# Altium schematic sheet Temp_recorder_SAMD21.SchDoc: 8 channel
size 420 x 297 mm; Author: G.Kasprowicz; CompanyName: WUT ISE; DrawnBy: G.Kasprowicz; Organization: WUT ISE; Address1: PW ISE; Address2: Nowowiejska 15/19 00-665 Warsaw; Address3: gkasprow@gmail.com; DocumentNumber: 1; Revision: 1.0; SheetNumber: 1; SheetTotal: 5; ModifiedBy: -; CheckedDate: -; Title2: temperature logger; DivGrp: WUT ISE; Designer: G.Kasprowicz; ModifiedDate: -; ProjectName: Sensor Box
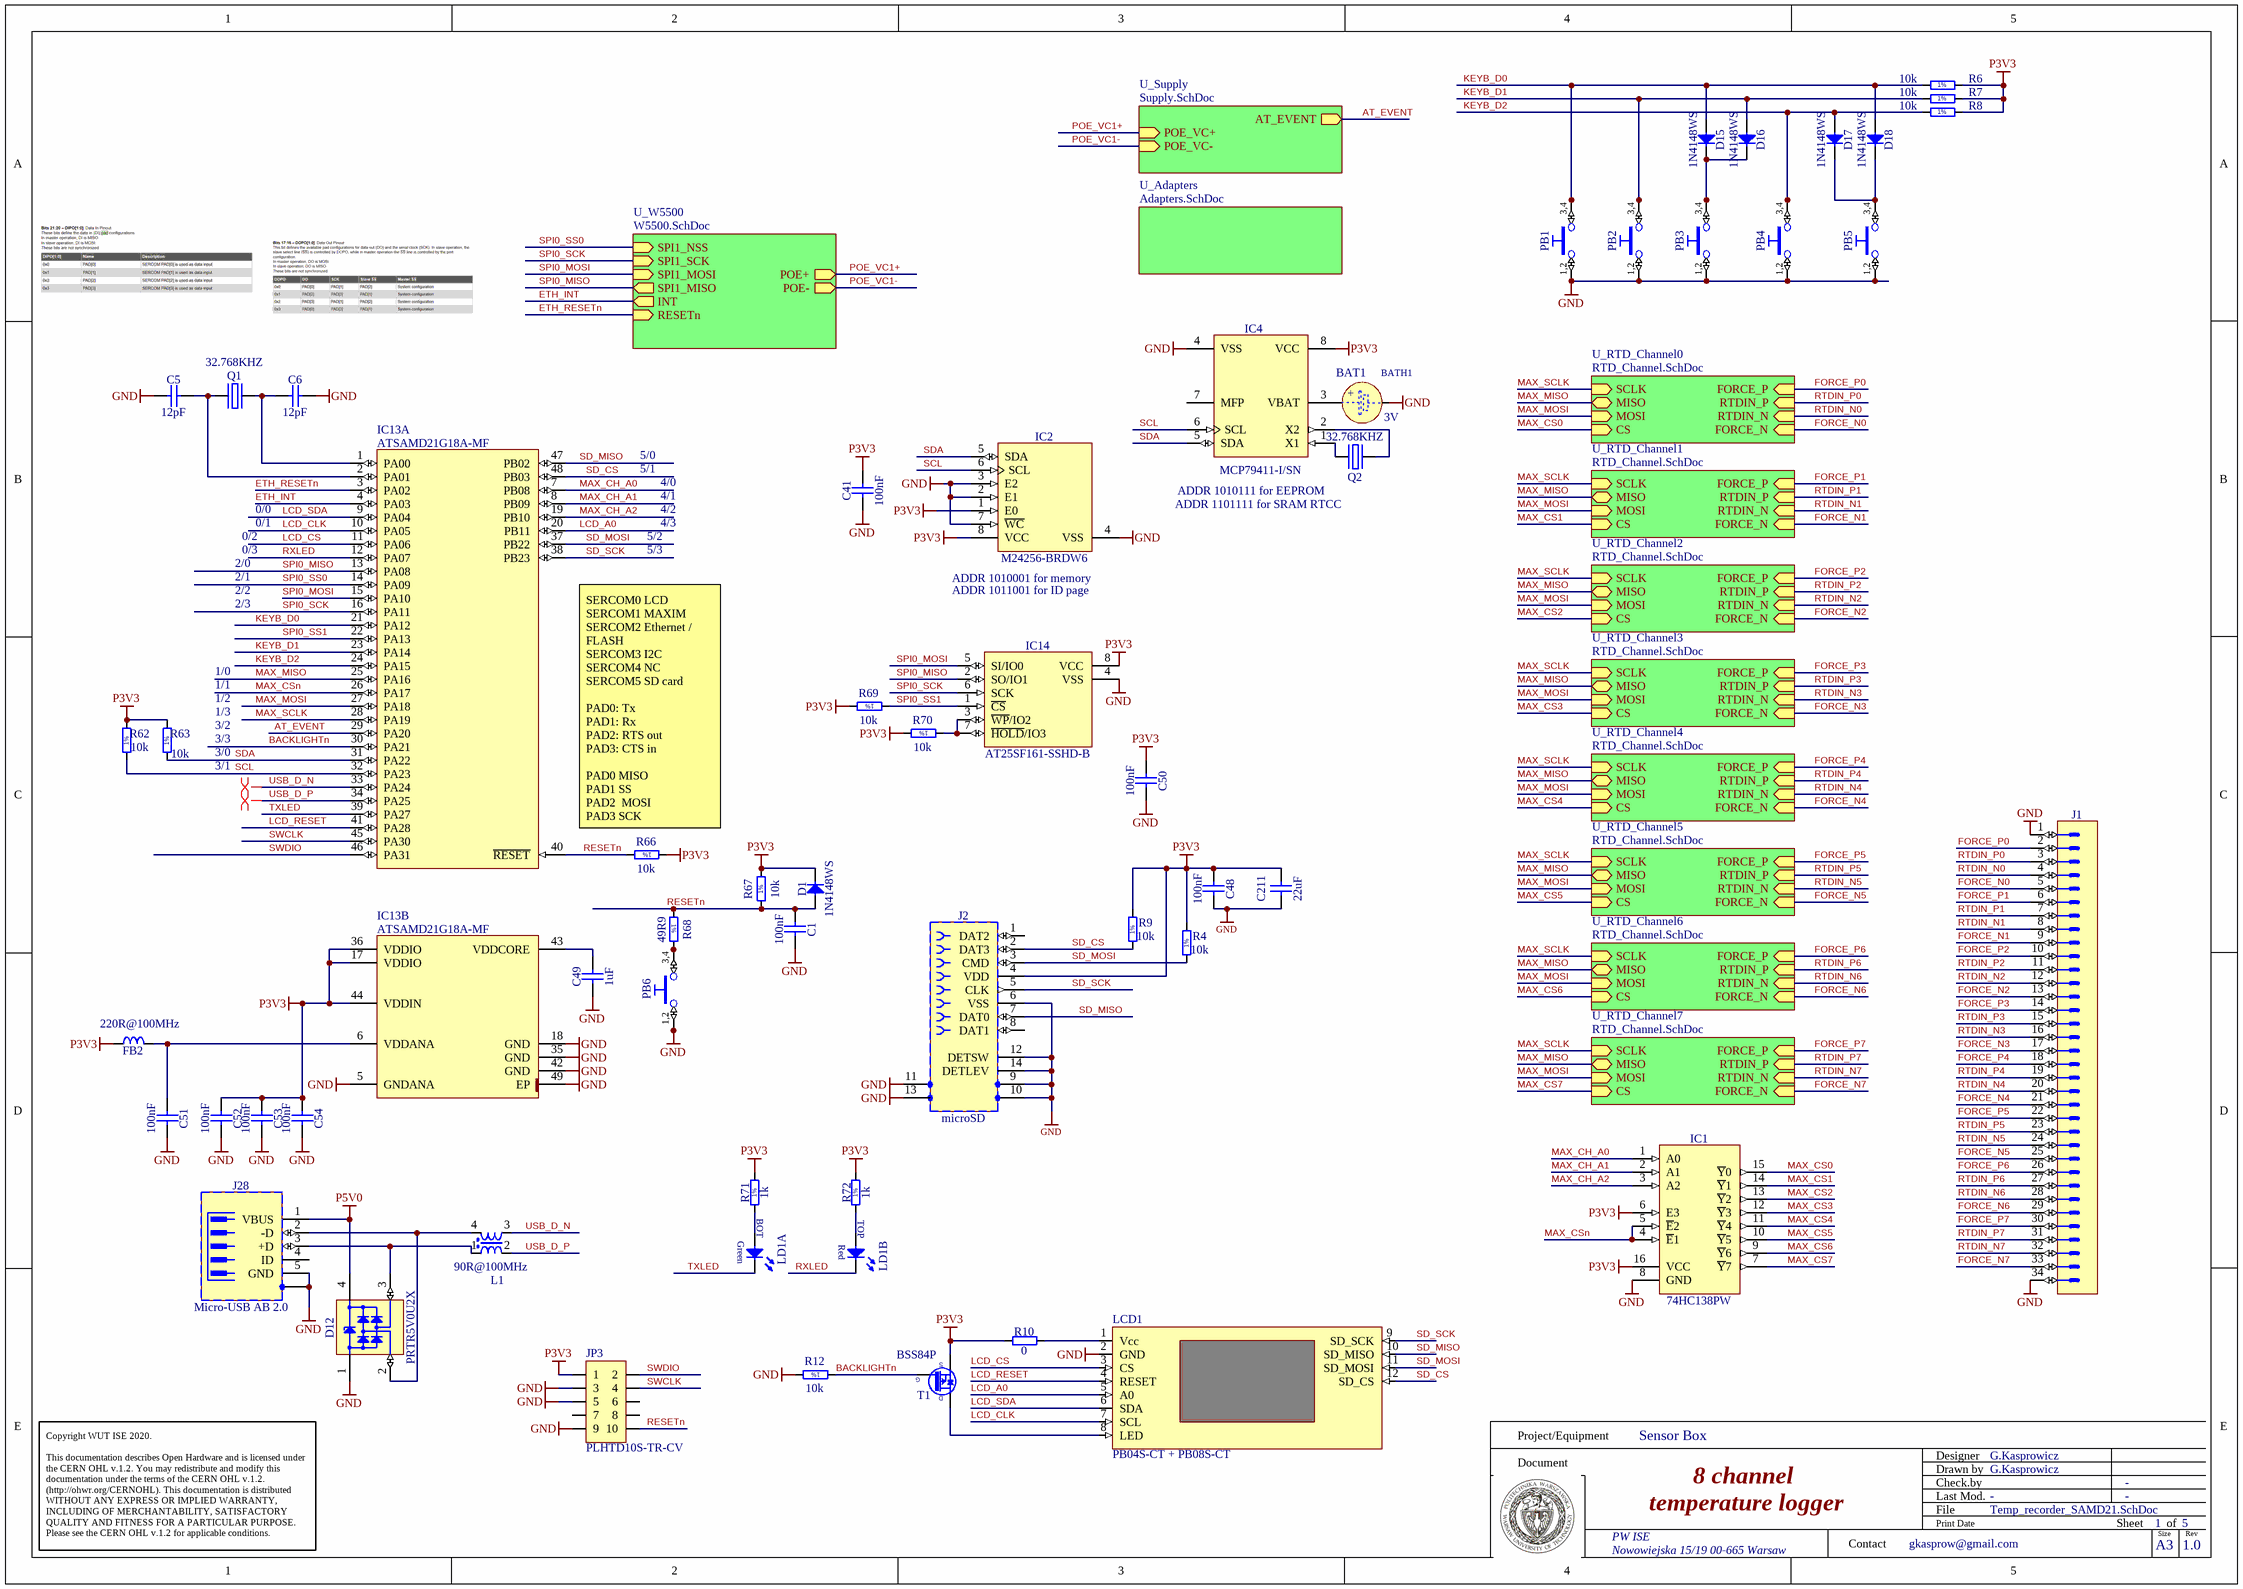
[diagram p0: Temp_recorder_SAMD21.SchDoc]

## Parts
BAT1  3V  [BAT_VARTA_CR1220]
BATH1  (no value)  [BATH_KEYSTONE_3000]
C1  100nF  [CAPC1005X55N]
C5  12pF  [CAPC1005X55N]
C6  12pF  [CAPC1005X55N]
C41  100nF  [CAPC1005X55N]
C48  100nF  [CAPC1005X55N]
C49  1uF  [CAPC1608X87N]
C50  100nF  [CAPC1005X55N]
C51  100nF  [CAPC1005X55N]
C52  100nF  [CAPC1005X55N]
C53  100nF  [CAPC1005X55N]
C54  100nF  [CAPC1005X55N]
C211  22uF  [CAPC2012X135N]
D1  1N4148WS  [SODFL2512X100N]
D12  PRTR5V0U2X  [SOT190P230X110-4N]
D15  1N4148WS  [SODFL2512X100N]
D16  1N4148WS  [SODFL2512X100N]
D17  1N4148WS  [SODFL2512X100N]
D18  1N4148WS  [SODFL2512X100N]
FB2  220R@100MHz  [INDC2012X105N]
IC1  74HC138PW  [SOP65P640X110-16N]
IC2  M24256-BRDW6  [SOP65P640X120-8N]
IC4  MCP79411-I/SN  [SOIC127P600X175-8N]
IC13  ATSAMD21G18A-MF  [QFN50P700X700X100-49N-S525]  (parts A,B of 2)
IC14  AT25SF161-SSHD-B  [SOIC127P790X216-8N]
J1  Header 34  [3M_N2534-5002RB]  (value not drawn)
J2  microSD  [MOLEX_502570-0893]
J28  Micro-USB AB 2.0  [HIROSE_ZX62RD-AB-5P8(30)]
JP3  PLHTD10S-TR-CV  [PLHTD10S-TR-CV]
L1  90R@100MHz  [IND_MURATA_DLW21S]
LCD1  PB04S-CT + PB08S-CT  [1.8TFT_Connectors]
LD1  Red/Green  [LED_DIALIGHT_571-0112F]  (value not drawn)  (parts A,B of 2)
PB1  Push Button  [PB_TYCO_FSM6JSMA]  (value not drawn)
PB2  Push Button  [PB_TYCO_FSM6JSMA]  (value not drawn)
PB3  Push Button  [PB_TYCO_FSM6JSMA]  (value not drawn)
PB4  Push Button  [PB_TYCO_FSM6JSMA]  (value not drawn)
PB5  Push Button  [PB_TYCO_FSM6JSMA]  (value not drawn)
PB6  Push Button  [PB_TYCO_FSM6JSMA]  (value not drawn)
Q1  32.768KHZ  [XTAL_ABRACON_ABS09]
Q2  32.768KHZ  [XTAL_ABRACON_ABS09]
R4  10k  [RESC1005X40N]
R6  10k  [RESC1005X40N]
R7  10k  [RESC1005X40N]
R8  10k  [RESC1005X40N]
R9  10k  [RESC1005X40N]
R10  0  [RESC1005X40N]
R12  10k  [RESC1005X40N]
R62  10k  [RESC1005X40N]
R63  10k  [RESC1005X40N]
R66  10k  [RESC1005X40N]
R67  10k  [RESC1005X40N]
R68  49R9  [RESC1005X40N]
R69  10k  [RESC1005X40N]
R70  10k  [RESC1005X40N]
R71  1k  [RESC1005X40N]
R72  1k  [RESC1005X40N]
T1  BSS84P  [SOT95P240X110-3N]

## Sub-sheets
U_Adapters = Adapters.SchDoc: no entries
U_RTD_Channel0 = RTD_Channel.SchDoc: SCLK (in), CS (in), MOSI (in), MISO (bidir), RTDIN_N (in), RTDIN_P (in), FORCE_P (in), FORCE_N (in)
U_RTD_Channel1 = RTD_Channel.SchDoc: SCLK (in), CS (in), MOSI (in), MISO (bidir), RTDIN_N (in), RTDIN_P (in), FORCE_P (in), FORCE_N (in)
U_RTD_Channel2 = RTD_Channel.SchDoc: SCLK (in), CS (in), MOSI (in), MISO (bidir), RTDIN_N (in), RTDIN_P (in), FORCE_P (in), FORCE_N (in)
U_RTD_Channel3 = RTD_Channel.SchDoc: SCLK (in), CS (in), MOSI (in), MISO (bidir), RTDIN_N (in), RTDIN_P (in), FORCE_P (in), FORCE_N (in)
U_RTD_Channel4 = RTD_Channel.SchDoc: SCLK (in), CS (in), MOSI (in), MISO (bidir), RTDIN_N (in), RTDIN_P (in), FORCE_P (in), FORCE_N (in)
U_RTD_Channel5 = RTD_Channel.SchDoc: SCLK (in), CS (in), MOSI (in), MISO (bidir), RTDIN_N (in), RTDIN_P (in), FORCE_P (in), FORCE_N (in)
U_RTD_Channel6 = RTD_Channel.SchDoc: SCLK (in), CS (in), MOSI (in), MISO (bidir), RTDIN_N (in), RTDIN_P (in), FORCE_P (in), FORCE_N (in)
U_RTD_Channel7 = RTD_Channel.SchDoc: SCLK (in), CS (in), MOSI (in), MISO (bidir), RTDIN_N (in), RTDIN_P (in), FORCE_P (in), FORCE_N (in)
U_Supply = Supply.SchDoc: AT_EVENT (out), POE_VC+ (in), POE_VC- (in)
U_W5500 = W5500.SchDoc: SPI1_NSS (in), SPI1_SCK (in), SPI1_MOSI (in), SPI1_MISO (out), INT (out), RESETn (in), POE+ (out), POE- (out)

## Nets
GND: BATH1.2(MINUS) C1.2 C5.1 C6.2 C41.1 C48.2 C49.1 C50.2 C51.2 C52.2 C53.2 C54.2 C211.1 D12.1(GND) IC1.8(GND) IC2.2(E1) IC2.3(E2) IC2.4(VSS) IC2.7(~{WC}) IC4.4(VSS) IC13.5(GNDANA) IC13.18(GND) IC13.35(GND) IC13.42(GND) IC13.49(EP) IC14.4(VSS) J1.1 J1.34 J2.6(VSS) J2.9 J2.10 J2.11 J2.12(DETSW) J2.13 J2.14(DETLEV) J28.5(GND) J28.6(SH) JP3.3 JP3.5 JP3.9 LCD1.2(GND) PB1.1 PB1.2 PB2.1 PB2.2 PB3.1 PB3.2 PB4.1 PB4.2 PB5.1 PB5.2 PB6.1 PB6.2 R12.2
P3V3: C41.2 C48.1 C50.1 C52.1 C53.1 C54.1 C211.2 D1.1(C) FB2.1 IC1.6(E3) IC1.16(VCC) IC2.1(E0) IC2.8(VCC) IC4.8(VCC) IC13.17(VDDIO) IC13.36(VDDIO) IC13.44(VDDIN) IC14.8(VCC) J2.4(VDD) JP3.1 R4.2 R6.2 R7.2 R8.2 R9.2 R10.1 R62.2 R63.2 R66.1 R67.2 R69.2 R70.2 R71.2 R72.2 T1.2(S)
P5V0: D12.4(VCC) J28.1(VBUS)
AT_EVENT: IC13.29(PA20) ; sheet U_Supply/AT_EVENT
BACKLIGHTn: IC13.30(PA21) R12.1 T1.1(G)
ETH_INT: IC13.4(PA03) ; sheet U_W5500/INT
ETH_RESETn: IC13.3(PA02) ; sheet U_W5500/RESETn
FORCE_N0: J1.5 ; sheet U_RTD_Channel0/FORCE_N
FORCE_N1: J1.9 ; sheet U_RTD_Channel1/FORCE_N
FORCE_N2: J1.13 ; sheet U_RTD_Channel2/FORCE_N
FORCE_N3: J1.17 ; sheet U_RTD_Channel3/FORCE_N
FORCE_N4: J1.21 ; sheet U_RTD_Channel4/FORCE_N
FORCE_N5: J1.25 ; sheet U_RTD_Channel5/FORCE_N
FORCE_N6: J1.29 ; sheet U_RTD_Channel6/FORCE_N
FORCE_N7: J1.33 ; sheet U_RTD_Channel7/FORCE_N
FORCE_P0: J1.2 ; sheet U_RTD_Channel0/FORCE_P
FORCE_P1: J1.6 ; sheet U_RTD_Channel1/FORCE_P
FORCE_P2: J1.10 ; sheet U_RTD_Channel2/FORCE_P
FORCE_P3: J1.14 ; sheet U_RTD_Channel3/FORCE_P
FORCE_P4: J1.18 ; sheet U_RTD_Channel4/FORCE_P
FORCE_P5: J1.22 ; sheet U_RTD_Channel5/FORCE_P
FORCE_P6: J1.26 ; sheet U_RTD_Channel6/FORCE_P
FORCE_P7: J1.30 ; sheet U_RTD_Channel7/FORCE_P
KEYB_D0: D15.2(A) D18.2(A) IC13.21(PA12) PB1.3 PB1.4 R6.1
KEYB_D1: D16.2(A) IC13.23(PA14) PB2.3 PB2.4 R7.1
KEYB_D2: D17.2(A) IC13.24(PA15) PB4.3 PB4.4 R8.1
LCD_A0: IC13.20(PB11) LCD1.5(A0)
LCD_CLK: IC13.10(PA05) LCD1.7(SCL)
LCD_CS: IC13.11(PA06) LCD1.3(CS)
LCD_RESET: IC13.41(PA28) LCD1.4(RESET)
LCD_SDA: IC13.9(PA04) LCD1.6(SDA)
MAX_CH_A0: IC1.1(A0) IC13.7(PB08)
MAX_CH_A1: IC1.2(A1) IC13.8(PB09)
MAX_CH_A2: IC1.3(A2) IC13.19(PB10)
MAX_CS0: IC1.15(~{Y}0) ; sheet U_RTD_Channel0/CS
MAX_CS1: IC1.14(~{Y}1) ; sheet U_RTD_Channel1/CS
MAX_CS2: IC1.13(~{Y}2) ; sheet U_RTD_Channel2/CS
MAX_CS3: IC1.12(~{Y}3) ; sheet U_RTD_Channel3/CS
MAX_CS4: IC1.11(~{Y}4) ; sheet U_RTD_Channel4/CS
MAX_CS5: IC1.10(~{Y}5) ; sheet U_RTD_Channel5/CS
MAX_CS6: IC1.9(~{Y}6) ; sheet U_RTD_Channel6/CS
MAX_CS7: IC1.7(~{Y}7) ; sheet U_RTD_Channel7/CS
MAX_CSn: IC1.4(~{E}1) IC1.5(~{E}2) IC13.26(PA17)
MAX_MISO: IC13.25(PA16) ; sheet U_RTD_Channel0/MISO, sheet U_RTD_Channel1/MISO, sheet U_RTD_Channel2/MISO, sheet U_RTD_Channel3/MISO, sheet U_RTD_Channel4/MISO, sheet U_RTD_Channel5/MISO, sheet U_RTD_Channel6/MISO, sheet U_RTD_Channel7/MISO
MAX_MOSI: IC13.27(PA18) ; sheet U_RTD_Channel0/MOSI, sheet U_RTD_Channel1/MOSI, sheet U_RTD_Channel2/MOSI, sheet U_RTD_Channel3/MOSI, sheet U_RTD_Channel4/MOSI, sheet U_RTD_Channel5/MOSI, sheet U_RTD_Channel6/MOSI, sheet U_RTD_Channel7/MOSI
MAX_SCLK: IC13.28(PA19) ; sheet U_RTD_Channel0/SCLK, sheet U_RTD_Channel1/SCLK, sheet U_RTD_Channel2/SCLK, sheet U_RTD_Channel3/SCLK, sheet U_RTD_Channel4/SCLK, sheet U_RTD_Channel5/SCLK, sheet U_RTD_Channel6/SCLK, sheet U_RTD_Channel7/SCLK
POE_VC1+: sheet U_W5500/POE+, sheet U_Supply/POE_VC+
POE_VC1-: sheet U_W5500/POE-, sheet U_Supply/POE_VC-
RESETn: C1.1 D1.2(A) IC13.40(~{RESET}) JP3.10 R66.2 R67.1 R68.1
RTDIN_N0: J1.4 ; sheet U_RTD_Channel0/RTDIN_N
RTDIN_N1: J1.8 ; sheet U_RTD_Channel1/RTDIN_N
RTDIN_N2: J1.12 ; sheet U_RTD_Channel2/RTDIN_N
RTDIN_N3: J1.16 ; sheet U_RTD_Channel3/RTDIN_N
RTDIN_N4: J1.20 ; sheet U_RTD_Channel4/RTDIN_N
RTDIN_N5: J1.24 ; sheet U_RTD_Channel5/RTDIN_N
RTDIN_N6: J1.28 ; sheet U_RTD_Channel6/RTDIN_N
RTDIN_N7: J1.32 ; sheet U_RTD_Channel7/RTDIN_N
RTDIN_P0: J1.3 ; sheet U_RTD_Channel0/RTDIN_P
RTDIN_P1: J1.7 ; sheet U_RTD_Channel1/RTDIN_P
RTDIN_P2: J1.11 ; sheet U_RTD_Channel2/RTDIN_P
RTDIN_P3: J1.15 ; sheet U_RTD_Channel3/RTDIN_P
RTDIN_P4: J1.19 ; sheet U_RTD_Channel4/RTDIN_P
RTDIN_P5: J1.23 ; sheet U_RTD_Channel5/RTDIN_P
RTDIN_P6: J1.27 ; sheet U_RTD_Channel6/RTDIN_P
RTDIN_P7: J1.31 ; sheet U_RTD_Channel7/RTDIN_P
RXLED: IC13.12(PA07) LD1.3(C)
SCL: IC2.6(SCL) IC4.6(SCL) IC13.32(PA23) R62.1
SD_CS: IC13.48(PB03) J2.2(DAT3) LCD1.12(SD_CS) R9.1
SD_MISO: IC13.47(PB02) J2.7(DAT0) LCD1.10(SD_MISO)
SD_MOSI: IC13.37(PB22) J2.3(CMD) LCD1.11(SD_MOSI) R4.1
SD_SCK: IC13.38(PB23) J2.5(CLK) LCD1.9(SD_SCK)
SDA: IC2.5(SDA) IC4.5(SDA) IC13.31(PA22) R63.1
SPI0_MISO: IC13.13(PA08) IC14.2(SO/IO1) ; sheet U_W5500/SPI1_MISO
SPI0_MOSI: IC13.15(PA10) IC14.5(SI/IO0) ; sheet U_W5500/SPI1_MOSI
SPI0_SCK: IC13.16(PA11) IC14.6(SCK) ; sheet U_W5500/SPI1_SCK
SPI0_SS0: IC13.14(PA09) ; sheet U_W5500/SPI1_NSS
SPI0_SS1: IC13.22(PA13) IC14.1(~{CS}) R69.1
SWCLK: IC13.45(PA30) JP3.4
SWDIO: IC13.46(PA31) JP3.2
TXLED: IC13.39(PA27) LD1.1(C)
USB_D_N: IC13.33(PA24) L1.3
USB_D_P: IC13.34(PA25) L1.2
NetBATH1_1: BATH1.1(PLUS) IC4.3(VBAT)
NetC5_2: C5.2 IC13.2(PA01) Q1.1(OSC1)
NetC6_1: C6.1 IC13.1(PA00) Q1.2(OSC2)
NetC49_2: C49.2 IC13.43(VDDCORE)
NetC51_1: C51.1 FB2.2 IC13.6(VDDANA)
NetD12_2: D12.2(I/O1) J28.2(-D) L1.4
NetD12_3: D12.3(I/O2) J28.3(+D) L1.1
NetD15_1: D15.1(C) D16.1(C) PB3.3 PB3.4
NetD17_1: D17.1(C) D18.1(C) PB5.3 PB5.4
NetIC4_1: IC4.1(X1) Q2.1(OSC1)
NetIC4_2: IC4.2(X2) Q2.2(OSC2)
NetIC14_3: IC14.3(~{WP}/IO2) IC14.7(~{HOLD}/IO3) R70.1
NetLCD1_1: LCD1.1(Vcc) R10.2
NetLCD1_8: LCD1.8(LED) T1.3(D)
NetLD1_2: LD1.2(A) R71.1
NetLD1_4: LD1.4(A) R72.1
NetPB6_3: PB6.3 PB6.4 R68.2

Not connected (* = marked no-connect by the designer): IC4 7(MFP); J2 1(DAT2) 8(DAT1); J28 4(ID); JP3 6 7 8

## Layout directives
differential pair: USB_D_N, USB_D_P

## Notes on the sheet
- 5/0
- 0/0
- 0/1
- 5/1
- 4/0
- 4/1
- 4/2
- 4/3
- ADDR 1101111 for SRAM RTCC
- ADDR 1010111 for EEPROM
- 2/0
- 2/1
- 2/2
- 0/2
- 0/3
- 5/2
- 5/3
- (near IC2) ADDR 1010001 for memory
- ADDR 1011001 for ID page
- 2/3
- (near R63) 3/2
- 1/0
- 1/1
- (near R63) 1/2
- (near R63) 1/3
- (near R63) 3/0
- (near R63) 3/1
- (near R63) 3/3
- SERCOM0 LCD
  SERCOM1 MAXIM
  SERCOM2 Ethernet / FLASH
  SERCOM3 I2C
  SERCOM4 NC
  SERCOM5 SD card
  PAD0: Tx
  PAD1: Rx
  PAD2: RTS out
  PAD3: CTS in
  PAD0 MISO
  PAD1 SS
  PAD2  MOSI
  PAD3 SCK
- Project/Equipment
- Document
- Designer
- Drawn by
- Check.by
- Copyright WUT ISE 2020.
  This documentation describes Open Hardware and is licensed under the CERN OHL v.1.2. You may redistribute and modify this documentation under the terms of the CERN OHL v.1.2. (http://ohwr.org/CERNOHL). This documentation is distributed WITHOUT ANY EXPRESS OR IMPLIED WARRANTY, INCLUDING OF MERCHANTABILITY, SATISFACTORY QUALITY AND FITNESS FOR A PARTICULAR PURPOSE. Please see the CERN OHL v.1.2 for applicable conditions.
- Contact
- File
- Last Mod.
- Print Date
- Sheet
- Size
- A3
- of
- Rev
- (in symbol BAT_VARTA_CR1220) +
- (in symbol BATH_KEYSTONE_3000) +
- (in symbol LED_DIALIGHT_571-0112F, part A) BOT; Green
- (in symbol LED_DIALIGHT_571-0112F, part B) TOP; Red
- (in symbol PB_TYCO_FSM6JSMA) 3,4; 1,2
- (in symbol R0402_1K_1%_0.0625W_100PPM) 1%
- (in symbol R0402_10K_1%_0.0625W_100PPM) 1%
- (in symbol R0402_49R9_1%_0.0625W_100PPM) 1%

## Library data of the parts
BAT1 = BAT_VARTA_CR1220: Battery for use only with Socket Holder; Part Description: CR1210, 12.5mm Diameter x 2mm  Height Lithium Coin Cells; Manufacturer: VARTA; Manufacturer Part Number: 6220; PressFit: No; Power: 35mAh; Part Number: BAT_VARTA_CR1220; Component Kind: Accessories; Component Type: Standard; Pin Count: 0; PackageDescription: CR1210, 12.5mm Diameter x 2mm  Height Lithium Coin Cells; Family: Battery; Mounted: Yes; Socket: Yes; SMD: No; Sense: No; Value: 3V; ComponentHeight: 2mm; HelpURL: \\cern.ch\dfs\Applications\Altium\Datasheets\BAT_VARTA_CR1220.pdf; Author: CERN DEM JLC; CreateDate: 17/04/2012; LatestRevisionDate: 17/04/2012
BATH1 = BATH_KEYSTONE_3000: Battery Holder whit 2 Pin; Part Description: SMD Battery Holder for CR1216, BR1220, CL1225, SR1120, D381, 391, 191 Coin Cells; Manufacturer Part Number: 3000; PressFit: No; Part Number: BATH_KEYSTONE_3000; Component Kind: Standard; Component Type: Standard; Pin Count: 3; PackageDescription: SMD Battery Holder for CR1216, BR1220, CL1225, SR1120, D381, 391, 191 Coin Cells; Family: Battery; Mounted: Yes; Socket: No; SMD: Yes; Sense: No; Manufacturer: KEYSTONE; ComponentHeight: 3.17mm; HelpURL: \\cern.ch\dfs\Applications\Altium\Datasheets\BATH_KEYSTONE_3000.pdf; Author: CERN DEM JLC; CreateDate: 17/04/2012; LatestRevisionDate: 07/06/2017
C1 C48 C50-C54 = CC0402_100NF_16V_10%_X7R: Non-polarised capacitor; Part Description: SMD Multilayer Chip Ceramic Capacitor; Manufacturer: GENERIC; Manufacturer1 Part Number: GRM155R71C104KA88D; Voltage: 16V; TC: X7R; Tolerance: ±10%; Part Number: CC0402_100NF_16V_10%_X7R; Component Kind: Standard; Component Type: Standard; Pin Count: 2; Value: 100nF; Status: Not Recommended; Manufacturer Part Number: CC0402_100NF_16V_10%_X7R; Case: 0402; Mounted: Yes; Socket: No; SMD: Yes; Manufacturer1 Example: MURATA; Manufacturer1 ComponentHeight: 0.55mm; HelpURL: \\cern.ch\dfs\Applications\Altium\Datasheets\CC0402_X7R_MURATA_GRM.pdf; Author: CERN DEM JLC; CreateDate: 05.12.2013; LatestRevisionDate: 03.12.2007; Sense: No
C5 C6 = CC0402_12PF_50V_5%_C0G: Non-polarised capacitor; Part Description: SMD Multilayer Chip Ceramic Capacitor; Manufacturer: GENERIC; Manufacturer1 Part Number: C0402C120J5GACTU; Voltage: 50V; TC: C0G/NP0; Tolerance: ±5%; Part Number: CC0402_12PF_50V_5%_C0G; Component Kind: Standard; Component Type: Standard; Pin Count: 2; Value: 12pF; Status: Preferred; Manufacturer Part Number: CC0402_12PF_50V_5%_C0G; Case: 0402; Mounted: Yes; Socket: No; SMD: Yes; Sense: No; Manufacturer1 Example: KEMET; Manufacturer1 ComponentHeight: 0.55mm; HelpURL: \\cern.ch\dfs\Applications\Altium\Datasheets\CC0805_C0G_KEMET_(Commercial Grade).pdf; Author: CERN DEM JLC; CreateDate: 04.10.2016; LatestRevisionDate: 04.10.2016
C41 = CC0402_100NF_16V_10%_X5R: Non-polarised capacitor; Part Description: SMD Multilayer Chip Ceramic Capacitor; Manufacturer: GENERIC; Manufacturer1 Part Number: GRM155R61C104KA88D; Voltage: 16V; TC: X5R; Tolerance: ±10%; Part Number: CC0402_100NF_16V_10%_X5R; Component Kind: Standard; Component Type: Standard; Pin Count: 2; Value: 100nF; Status: None; Manufacturer Part Number: CC0402_100NF_16V_10%_X5R; Case: 0402; Mounted: Yes; Socket: No; SMD: Yes; Sense: No; Manufacturer1 Example: MURATA; Manufacturer1 ComponentHeight: 0.55mm; HelpURL: \\cern.ch\dfs\Applications\Altium\Datasheets\CC0402_X5R_MURATA_GRM.pdf; Author: CERN DEM JLC; CreateDate: 10.12.2013; LatestRevisionDate: 10.12.2013
C49 = CC0603_1UF_16V_10%_X7R: Non-polarised capacitor; Part Description: SMD Multilayer Chip Ceramic Capacitor; Manufacturer: GENERIC; Manufacturer1 Part Number: 223878615663; Voltage: 16V; TC: X7R; Tolerance: ±10%; Part Number: CC0603_1UF_16V_10%_X7R; Component Kind: Standard; Component Type: Standard; Pin Count: 2; Value: 1uF; Status: None; Manufacturer Part Number: CC0603_1uF_16V_10%_X7R; Case: 0603; Mounted: Yes; Socket: No; SMD: Yes; Sense: No; Manufacturer1 Example: YAGEO PHYCOMP; Manufacturer1 ComponentHeight: 0.9mm; HelpURL: \\cern.ch\dfs\Applications\Altium\Datasheets\CC0603_X7R_PHYCOMP.pdf; Author: CERN DEM JLC; CreateDate: 03.12.2007; LatestRevisionDate: 17.04.2015
C211 = CC0805_22UF_16V_10%_X5R: Non-polarised capacitor; Part Description: SMD Multilayer Chip Ceramic Capacitor; Manufacturer: GENERIC; Manufacturer1 Part Number: C2012X5R1C226KT; Voltage: 16V; TC: X5R; Tolerance: ±10%; Part Number: CC0805_22UF_16V_10%_X5R; Component Kind: Standard; Component Type: Standard; Pin Count: 2; Value: 22uF; Status: Preferred; Manufacturer Part Number: CC0805_22UF_16V_10%_X5R; Case: 0805; Mounted: Yes; Socket: No; SMD: Yes; Sense: No; Manufacturer1 Example: TDK; Manufacturer1 ComponentHeight: 1.35mm; HelpURL: \\cern.ch\dfs\Applications\Altium\Datasheets\CC0805_X5R_TDK_C.pdf; Author: CERN DEM JLC; CreateDate: 25.10.2012; LatestRevisionDate: 25.10.2012
D1 D15-D18 = 1N4148WS: Diode; Part Description: Small Signal Diodes; Manufacturer: FAIRCHILD SEMICONDUCTOR; Voltage: 75V; Power: 150mA; PressFit: No; Bonding: No; Part Number: 1N4148WS; Component Kind: Standard; Component Type: Standard; Device: 1N4148WS; PackageDescription: SODFL Diode; 1.70mm W X 1.25mm L X 1.00mm H body, IPC Medium Density; Manufacturer Part Number: 1N4148WS; Pin Count: 2; Case: SOD-323F; Mounted: Yes; Socket: No; SMD: Yes; Sense: No; ComponentHeight: 1mm; HelpURL: \\cern.ch\dfs\Applications\Altium\Datasheets\1N4148WS.pdf; Author: CERN DEM JLC; CreateDate: 12.05.2011; LatestRevisionDate: 12.05.2011
D12 = PRTR5V0U2X: Ultra Low Capacitance Double Rail-to-Rail ESD Protection Diode; Part Description: Ultra Low Capacitance (1pF) Double Rail-to-Rail ESD Protection Diode (8kV); Manufacturer: NXP SEMICONDUCTORS; Voltage: 5.5V; PressFit: No; Bonding: No; Table: Diodes; Part Number: PRTR5V0U2X; Component Kind: Standard; Component Type: Standard; Device: PRTR5V0U2X; PackageDescription: SOT143B, SOT, 1.90mm Pitch; 4 Pin, 1.30mm W X 2.90mm L X 1.10mm H body, IPC Medium Density; Manufacturer Part Number: PRTR5V0U2X; Pin Count: 4; Case: SOT143B; Mounted: Yes; Socket: No; SMD: Yes; ComponentHeight: 1.1mm; HelpURL: \\cern.ch\dfs\Applications\Altium\Datasheets\PRTR5V0U2X.pdf; Author: CERN DEM JLC; CreateDate: 2011-03-22; LatestRevisionDate: 2011-03-22
FB2 = IND0805_MURATA_BLM21PG221SN1D: Inductor; Part Description: SMD EMIFIL Suppression Chip Ferrite Bead; Manufacturer: MURATA; Power: 2A; Resistance: 0.05R; Tolerance: ±25%; Table: Inductors SMD; Part Number: IND0805_MURATA_BLM21PG221SN1D; Component Kind: Standard; Component Type: Standard; Pin Count: 2; Value: 220R@100MHz; Status: None; Manufacturer Part Number: BLM21PG221SN1D; Case: 0805; Mounted: Yes; Socket: No; SMD: Yes; ComponentHeight: 1.05mm; HelpURL: \\cern.ch\dfs\Applications\Altium\Datasheets\IND0402_MURATA_BLM21P.pdf; Author: CERN DEM JLC; CreateDate: 2010-01-25; LatestRevisionDate: 2010-01-25
IC1 = 74HC138PW: 3-Line to 8-Line Decoder/Demultiplexer; Part Description: 3-Line to 8-Line Decoder/Demultiplexer, Inverting; Manufacturer: NXP SEMICONDUCTORS; PressFit: No; Bonding: No; Part Number: 74HC138PW; Component Kind: Standard; Component Type: Standard; Device: 74HC138PW; PackageDescription: SOP, 0.65mm pitch; 16 pin, 4.40mm W X 5.00mm L X 1.10mm H body IPC Medium Density; Manufacturer Part Number: 74HC138PW; Pin Count: 16; Case: TSSOP16; Mounted: Yes; Socket: No; SMD: Yes; Sense: No; ComponentHeight: 1.1mm; Author: CERN DEM JLC; HelpURL: \\cern.ch\dfs\Applications\Altium\Datasheets\74HC138PW.pdf; CreateDate: 09/06/2015; LatestRevisionDate: 09/06/2015
IC2 = MEM_M24256-BRDW6P: 256-Kbit Serial I²C Bus EEPROM; Manufacturer: ST MICROELECTRONICS; PressFit: No; Bonding: No; Part Number: M24256-BRDW6P; Component Kind: Standard; Component Type: Standard; Device: M24256-BRDW6; PackageDescription: SOP, 0.65mm pitch; 8 pin, 4.40mm W X 3.00mm L X 1.20mm H body, IPC Medium Density; Part Description: 256-Kbit Serial I²C Bus EEPROM; Manufacturer Part Number: M24256-BRDW6; Pin Count: 8; Case: TSSOP8; Mounted: Yes; Socket: No; SMD: Yes; Sense: No; ComponentHeight: 1.2mm; HelpURL: \\cern.ch\dfs\Applications\Altium\Datasheets\M24256-BRDW6P.pdf; Author: CERN DEM MR; CreateDate: 17.03.2016; LatestRevisionDate: 17.03.2016
IC4 = RTC_MCP79411: I2C Real-Time Clock/Calendar with EEPROM, SRAM, Unique ID and Battery Switchover; Manufacturer: MICROCHIP TECHNOLOGY; PressFit: No; Bonding: No; Part Number: MCP79411-I/SN; Component Kind: Standard; Component Type: Standard; Device: MCP79411-I/SN; PackageDescription: SOIC 8, Pitch 1.27mm - Body 3.9x4.9mm, IPC Medium Density; Part Description: I2C Real-Time Clock/Calendar with EEPROM, SRAM, Unique ID and Battery Switchover; Manufacturer Part Number: MCP79411-I/SN; Pin Count: 8; Case: SOIC8; Mounted: Yes; Socket: No; SMD: Yes; Sense: No; ComponentHeight: 1.75mm; HelpURL: \\cern.ch\dfs\Applications\Altium\Datasheets\MCP79410-I-SN.pdf; Author: GK; CreateDate: 2015-07-10; LatestRevisionDate: 2015-07-10
IC13 = ATSAMD21G18A-MF: 32-bit ARM®-based Cortex®-M0+ core Microcontroller, 1.62V to 3.6V, 48MHz, 256KB Flash, 32KB of SRAM, 48 QFN, Industrial Grade (-40°C to 125°C); Part Description: 32-bit ARM®-based Cortex®-M0+ core Microcontroller, 1.62V to 3.6V, 48MHz, 256KB Flash, 32KB SRAM, 48 QFN, Temperature Range -40°C to 125°C; Manufacturer: MICROCHIP; PressFit: No; Bonding: No; Part Number: ATSAMD21G18A-MF; Component Kind: Standard; Component Type: Standard; Device: ATSAMD21G18A-MF; PackageDescription: QFN, 0.50mm Pitch, Square; 48 Pin, 7.00mm L X 7.00mm W X 1mm H Body (W/Thermal Tab 5.25mm X 5.25mm), IPC Medium Density; Manufacturer Part Number: ATSAMD21G18A-MF; Pin Count: 49; Case: QFN48; Mounted: Yes; Socket: No; SMD: Yes; Sense: No; ComponentHeight: 1mm; HelpURL: \\cern.ch\dfs\Applications\Altium\Datasheets\ATSAMD21G18A-MF.pdf; Author: CERN DEM BC; CreateDate: 23.01.2018; LatestRevisionDate: 23.01.2018
IC14 = MEM_AT25SF161: 16Mb, 3V, Multiple I/O Serial NOR Flash Memory; Part Description: 16Mb, 2.7 to 3.6V, SPI Flash Memory; PressFit: No; Bonding: No; Part Number: AT25SF161-SSHD-B; Component Kind: Standard; Component Type: Standard; Device: AT25SF161-SSHD-B; PackageDescription: SOIC, 1.27mm Pitch; 8 Pin, 5.285mm W X 5.335mm L X 2.16mm H body, IPC Medium Density; Manufacturer Part Number: AT25SF161-SSHD-B; Pin Count: 8; Case: SOIC8; Mounted: Yes; Socket: No; SMD: Yes; Sense: No; ComponentHeight: 2.16mm; HelpURL: \\cern.ch\dfs\Applications\Altium\Datasheets\N25Q128A13ESE40.pdf; Author: GK; CreateDate: 28.11.2011; LatestRevisionDate: 30.07.2015
J1 = 3M_N2534-5002RB: Connector 34 Male; Part Description: 34 Contacts - Right Angle .100" x .100" Low Profile Four-Wall Header, 2500 Series; Manufacturer: 3M; PressFit: No; Part Number: 3M_N2534-5002RB; Component Kind: Standard; Component Type: Standard; Pin Count: 34; Family: Header 34; Mounted: Yes; Socket: No; SMD: No; Sense: No; Status: None; Manufacturer Part Number: N2534-5002RB; ComponentHeight: 8.59mm; HelpURL: \\cern.ch\dfs\Applications\Altium\Datasheets\3M_N2534-5002RB.pdf; Author: CERN DEM JLC; CreateDate: 29/10/2008; LatestRevisionDate: 11/08/2009
J2 = MOLEX_502570-0893: Connector MicroSD 8 Pin; Part Description: 1.10mm Pitch, Surface Mount, Normal Mount MicroSD Memory Card Connector; Manufacturer: MOLEX; PressFit: No; Part Number: MOLEX_502570-0893; Component Kind: Standard; Component Type: Standard; Pin Count: 12; Family: microSD; Mounted: Yes; Socket: No; SMD: Yes; Sense: No; Status: None; Manufacturer Part Number: 502570-0893; ComponentHeight: 2.03mm; HelpURL: \\cern.ch\dfs\Applications\Altium\Datasheets\MOLEX_502570-0893.pdf; Author: CERN DEM JLC; CreateDate: 22.01.2015; LatestRevisionDate: 22.01.2015
J28 = HIROSE_ZX62RD-AB-5P8(30): 5 Pin + 1 Shield USB Receptacle; Part Description: Micro-USB 2.0 Right Angle, SMD Type AB - Reverse (Top mount), Shell Through Hole; Manufacturer: HIROSE (HRS); PressFit: No; Part Number: HIROSE_ZX62RD-AB-5P8(30); Component Kind: Standard; Component Type: Standard; Pin Count: 7; Family: Micro-USB AB 2.0; Mounted: Yes; Socket: No; SMD: Yes; Sense: No; Status: None; Manufacturer Part Number: ZX62RD-AB-5P8(30); ComponentHeight: 2.35mm; HelpURL: \\cern.ch\dfs\Applications\Altium\Datasheets\HIROSE_ZX62RD-AB-5P8(30).pdf; ComponentLink1URL: \\cern.ch\dfs\Applications\Altium\Datasheets\HIROSE_ZX62RD-AB-5P8(30)_Package-Drawing.pdf; ComponentLink1Description: Package-Drawing; Author: CERN DEM JMW; CreateDate: 22/06/2017; LatestRevisionDate: 22/06/2017
JP3 = CON_2x5 1.27 SMT Male: 1.27 mm dual row goldpin (Maritex)
L1 = IND_MURATA_DLW21SN900SQ2L: Inductor Common Mode; Part Description: Wire Wound Common Mode Choke Coil (DLW21S Series); Manufacturer: MURATA; Power: 330mA; Resistance: 0.35R; Tolerance: ±25%; Table: Inductors SMD; Part Number: IND_MURATA_DLW21SN900SQ2L; Component Kind: Standard; Component Type: Standard; Pin Count: 4; Value: 90R@100MHz; Status: None; Manufacturer Part Number: DLW21SN900SQ2L; Case: 0805; Mounted: Yes; Socket: No; SMD: Yes; ComponentHeight: 1.4mm; HelpURL: \\cern.ch\dfs\Applications\Altium\Datasheets\IND_MURATA_DLW21S.pdf; Author: CERN DEM JLC; CreateDate: 2014-07-01; LatestRevisionDate: 2014-07-01
LCD1 = LCD_TFT_1.8_SD_Connectos: 1.8"TFT display and SD card connector
LD1 = LED_DIALIGHT_571-0112F: 2x LED  Botom Green, Top Red; Part Description: Dual 2mm  LEDs, Red Top,Green Bot, CBI® Circuit Board Indicator (Without positioning pins); PressFit: No; Bonding: No; Part Number: LED_DIALIGHT_571-0112F; Component Kind: Standard; Component Type: Standard; Color: Red/Green; PackageDescription: 2x 2mm LED (Top: Red, Bot: Green) PCB Edge Mounting (Without positioning pins) DIALIGHT 571 Serie; Manufacturer: DIALIGHT; Manufacturer Part Number: 571-0112F; Pin Count: 4; Mounted: Yes; Socket: No; SMD: No; Sense: No; ComponentHeight: 8.6mm; HelpURL: \\cern.ch\dfs\Applications\Altium\Datasheets\LED_DIALIGHT_571-0112F.pdf; Author: CERN DEM JLC; CreateDate: 09.11.2009; LatestRevisionDate: 17.03.2010
PB1-PB6 = PB_TYCO_FSM6JSMA: Push-Button Switch SPDT; Part Description: 12VDC 50mA SPST Tactile  Push-Button Switch; Manufacturer: TYCO ELECTRONICS; Manufacturer Part Number: FSM6JSMA or  4-1437565-9; PressFit: No; Part Number: PB_TYCO_FSM6JSMA; Component Kind: Standard; Component Type: Standard; Pin Count: 4; PackageDescription: Body 6mm x 6mm, Surface Mount Tactile Switches, TYCO ALCOSWITCH FSMJSMA Series; Family: Push Button; Mounted: Yes; Socket: No; SMD: Yes; Sense: No; Status: None; ComponentHeight: 7.11mm; HelpURL: \\cern.ch\dfs\Applications\Altium\Datasheets\PB_TYCO_FSM6JSMA.pdf; Author: CERN DEM JLC; CreateDate: 21/06/2012; LatestRevisionDate: 21/06/2012
Q1 Q2 = XTAL_32.768KHZ_ABRACON_ABS09-32.768KHZ-T: Quartz Crystal; Part Description: Tolerance: ±20ppm, Stability: ±5ppm, -40°C to +85°C, 12.5pF, SMD Low Profile Crystal, ABS09 Series; PressFit: No; Bonding: No; Part Number: XTAL_32.768KHZ_ABRACON_ABS09-32.768KHZ-T; Component Kind: Standard; Component Type: Standard; PackageDescription: 2 Pins, 4.1x1.5mm, SMD Low Profile Crystal, ABS09 Serie; Value: 32.768KHZ; Manufacturer: ABRACON; Manufacturer Part Number: ABS09-32.768KHZ-T; Pin Count: 2; Mounted: Yes; Socket: No; SMD: Yes; Sense: No; ComponentHeight: 0.9mm; HelpURL: \\cern.ch\dfs\Applications\Altium\Datasheets\XTAL_ABRACON_ABS09.pdf; Author: CERN DEM JLC; CreateDate: 16.10.2014; LatestRevisionDate: 16.10.2014
R4 R6-R9 R12 R62 R63 R66 R67 R69 R70 = R0402_10K_1%_0.0625W_100PPM: Resistor - 1%; Part Description: General Purpose Thick Film Chip Resistor; Manufacturer: GENERIC; Manufacturer1 Part Number: 232270671003L; TC: ±100ppm/°C; Table: Resistors SMD; Part Number: R0402_10K_1%_0.0625W_100PPM; Component Kind: Standard; Component Type: Standard; Pin Count: 2; Value: 10k; Status: Not recommended; Power: 0.0625W; Tolerance: ±1%; Manufacturer Part Number: R0402_10K_1%_0.0625W_100PPM; Case: 0402; Mounted: Yes; Socket: No; SMD: Yes; Manufacturer1 Example: YAGEO PHYCOMP; Manufacturer1 ComponentHeight: 0.4mm; HelpURL: \\cern.ch\dfs\Applications\Altium\Datasheets\R0402_Phycomp_RC0402.pdf; Author: CERN DEM JLC; CreateDate: 2007-12-03; LatestRevisionDate: 2012-10-17
R10 = R0402_0R_JUMPER: Resistor; Part Description: 1A (0.05R Max DC Resistance) Zero Ohm Jumper; Manufacturer: GENERIC; Manufacturer1 Part Number: 232270591001L; PressFit: No; Part Number: R0402_0R_JUMPER; Component Kind: Standard; Component Type: Standard; Pin Count: 2; Value: 0; Status: Not Recommended; Manufacturer Part Number: R0402_0R_JUMPER; Case: 0402; Mounted: Yes; Sense: No; Socket: No; SMD: Yes; Manufacturer1 Example: YAGEO PHYCOMP; Manufacturer1 ComponentHeight: 0.4mm; HelpURL: \\cern.ch\dfs\Applications\Altium\Datasheets\R0402_Phycomp_RC0402.pdf; Author: CERN DEM JLC; CreateDate: 03/12/2007; LatestRevisionDate: 17/10/2012
R68 = R0402_49R9_1%_0.0625W_100PPM: Resistor - 1%; Part Description: General Purpose Thick Film Chip Resistor; Manufacturer: GENERIC; Manufacturer1 Part Number: 232270674999L or RC0402FR-0749R9L; TC: ±100ppm/°C; Table: Resistors SMD; Part Number: R0402_49R9_1%_0.0625W_100PPM; Component Kind: Standard; Component Type: Standard; Pin Count: 2; Value: 49R9; Status: Not recommended; Power: 0.0625W; Tolerance: ±1%; Manufacturer Part Number: R0402_49R9_1%_0.0625W_100PPM; Case: 0402; Mounted: Yes; Socket: No; SMD: Yes; Manufacturer1 Example: YAGEO PHYCOMP; Manufacturer1 ComponentHeight: 0.4mm; HelpURL: \\cern.ch\dfs\Applications\Altium\Datasheets\R0402_Phycomp_RC0402.pdf; Author: CERN DEM JLC; CreateDate: 2012-10-24; LatestRevisionDate: 2012-10-24
R71 R72 = R0402_1K_1%_0.0625W_100PPM: Resistor - 1%; Part Description: General Purpose Thick Film Chip Resistor; Manufacturer: GENERIC; Manufacturer1 Part Number: 232270671002L; TC: ±100ppm/°C; PressFit: No; Part Number: R0402_1K_1%_0.0625W_100PPM; Component Kind: Standard; Component Type: Standard; Pin Count: 2; Value: 1k; Status: Not Recommended; Power: 0.0625W; Tolerance: ±1%; Manufacturer Part Number: R0402_1K_1%_0.0625W_100PPM; Case: 0402; Mounted: Yes; Sense: No; Socket: No; SMD: Yes; Manufacturer1 Example: YAGEO PHYCOMP; Manufacturer1 ComponentHeight: 0.4mm; HelpURL: \\cern.ch\dfs\Applications\Altium\Datasheets\R0402_Phycomp_RC0402.pdf; Author: CERN DEM JLC; CreateDate: 03.12.2007; LatestRevisionDate: 17.10.2012
T1 = BSS84P: P-CHANNEL MOSFET WITH DIODE; Part Description: -60V -170mA P-Channel SIPMOS Small-Signal Transistor; Manufacturer: INFINEON; PressFit: No; Bonding: No; Part Number: BSS84P; Component Kind: Standard; Component Type: Standard; Device: BSS84P; PackageDescription: SOT23 3-Leads, Pitch 0.95mm - Body 1.4x3mm, IPC Medium Density; Manufacturer Part Number: BSS84P; Pin Count: 3; Case: SOT23-3; Mounted: Yes; Socket: No; SMD: Yes; Sense: No; ComponentHeight: 1.1mm; HelpURL: \\cern.ch\dfs\Applications\Altium\Datasheets\BSS84P.pdf; Author: CERN DEM JLC; CreateDate: 11/07/2018; LatestRevisionDate: 11/07/2018